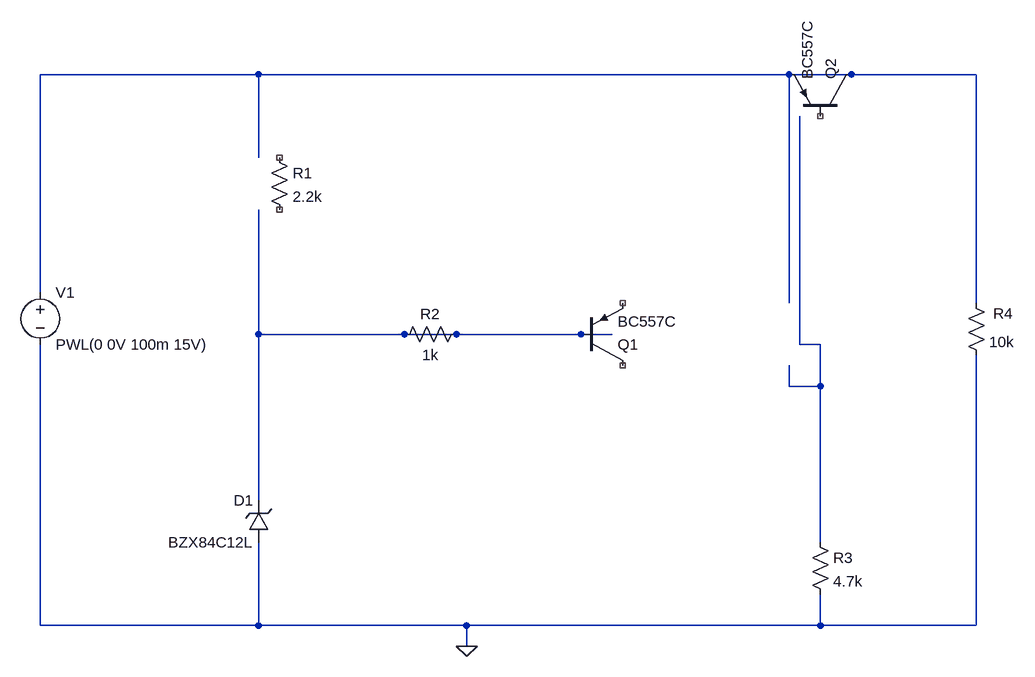
[diagram p0: schematic pnp.asc]
pnp.asc, the LTspice schematic file:
Version 4
SHEET 1 1476 712
WIRE 304 -208 -32 -208
WIRE 1120 -208 304 -208
WIRE 1408 -208 1120 -208
WIRE 304 -80 304 -208
WIRE -32 128 -32 -208
WIRE 1120 144 1120 -208
WIRE 1408 144 1408 -208
WIRE 304 192 304 0
WIRE 592 192 304 192
WIRE 848 192 592 192
WIRE 1136 208 1136 -144
WIRE 1168 208 1136 208
WIRE 1120 272 1120 240
WIRE 1168 272 1168 208
WIRE 1168 272 1120 272
WIRE 304 448 304 192
WIRE 1168 512 1168 272
WIRE -32 640 -32 208
WIRE 304 640 304 512
WIRE 304 640 -32 640
WIRE 624 640 304 640
WIRE 1168 640 1168 592
WIRE 1168 640 624 640
WIRE 1408 640 1408 224
WIRE 1408 640 1168 640
WIRE 624 672 624 640
FLAG 624 672 0
SYMBOL voltage -32 112 R0
WINDOW 123 0 0 Left 0
WINDOW 39 0 0 Left 0
SYMATTR InstName V1
SYMATTR Value PWL(0 0V 100m 15V)
SYMBOL res 320 -96 R0
SYMATTR InstName R1
SYMATTR Value 2.2k
SYMBOL res 624 176 R90
WINDOW 0 0 56 VBottom 2
WINDOW 3 32 56 VTop 2
SYMATTR InstName R2
SYMATTR Value 1k
SYMBOL res 1152 496 R0
SYMATTR InstName R3
SYMATTR Value 4.7k
SYMBOL res 1392 128 R0
WINDOW 0 42 32 Left 2
SYMATTR InstName R4
SYMATTR Value 10k
SYMBOL pnp 800 240 M180
SYMATTR InstName Q1
SYMATTR Value BC557C
SYMBOL pnp 1216 -144 M270
SYMATTR InstName Q2
SYMATTR Value BC557C
SYMBOL zener 320 512 R180
WINDOW 0 24 64 Left 2
WINDOW 3 24 0 Left 2
SYMATTR InstName D1
SYMATTR Value BZX84C12L

The netlist it stands for:
* pnp.asc
V1 N001 0 PWL(0 0V 100m 15V)
R1 NC_01 NC_02 2.2k
R2 N002 N002 1k
R3 N003 0 4.7k
R4 N001 0 10k
* Q1: BC557C (symbol pnp not certain, pin order unknown); nets seen at it: 0, N002
* Q2: BC557C (symbol pnp not certain, pin order unknown); nets seen at it: 0, N001
D1 0 N002 BZX84C12L
.model D D
.lib standard.dio
.backanno
.end